# EAGLE design RFM22_AT90USB (EAGLE 5.11)
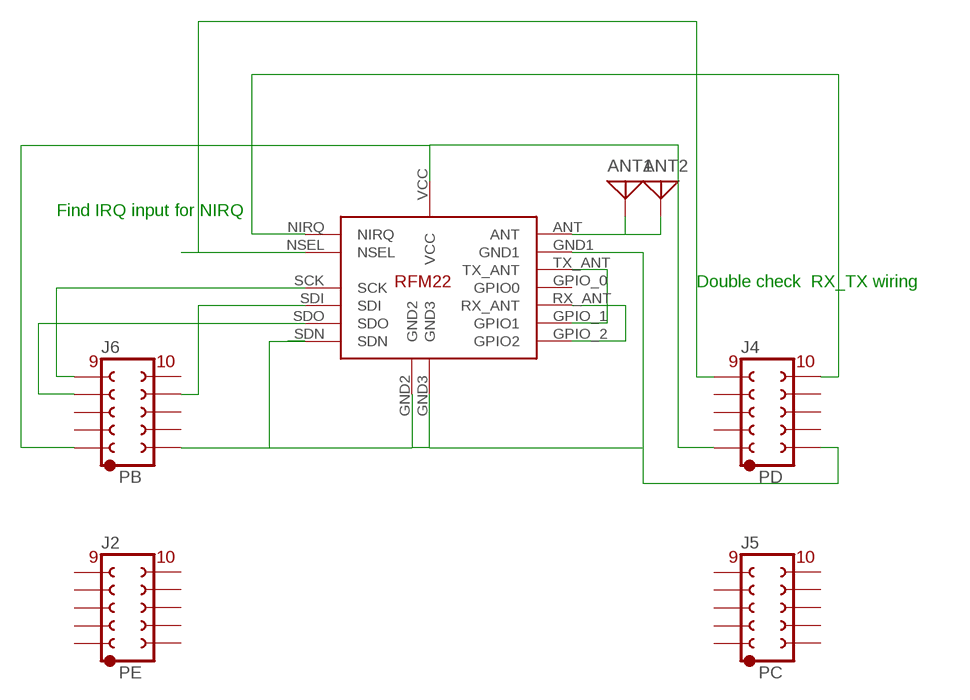
[diagram p0: schematic, sheet 1]

## Parts
ANT1  ANTENNA  [PAD-01]
ANT2  ANTENNA  [PAD-01]
J2  PE  HDR50X100  [5X2_50MILX100MIL]
J4  PD  HDR50X100  [5X2_50MILX100MIL]
J5  PC  HDR50X100  [5X2_50MILX100MIL]
J6  PB  HDR50X100  [5X2_50MILX100MIL]
U$1  RFM22  [RFM22]

## Nets
GND: J4.P$2 J6.P$2 U$1.GND1 U$1.GND2 U$1.GND3 U$1.SDN
N$1: J4.P$1 J6.P$1 U$1.VCC
N$3: J4.P$10 U$1.NIRQ
N$4: J6.P$9 U$1.SCK
N$5: J6.P$8 U$1.SDI
N$6: J6.P$7 U$1.SDO
N$7: J4.P$9 U$1.NSEL
N$9: U$1.GPIO_2(GPIO2) U$1.RX_ANT
N$10: U$1.GPIO_1(GPIO1) U$1.TX_ANT
N$11: ANT1.1 ANT2.1 U$1.ANT
Unconnected: J2.P$1 J2.P$2 J2.P$3 J2.P$4 J2.P$5 J2.P$6 J2.P$7 J2.P$8 J2.P$9 J2.P$10 J4.P$3 J4.P$4 J4.P$5 J4.P$6 J4.P$7 J4.P$8 J5.P$1 J5.P$2 J5.P$3 J5.P$4 J5.P$5 J5.P$6 J5.P$7 J5.P$8 J5.P$9 J5.P$10 J6.P$3 J6.P$4 J6.P$5 J6.P$6 J6.P$10 U$1.GPIO_0(GPIO0)

## Notes on the sheet
- Find IRQ input for NIRQ
- Double check  RX_TX wiring

## Library data of the parts
ANT1 ANT2 = discrete:ANTENNA: Antenna
J2 J4-J6 = MY_ATMEL:HDR50X100: Connector 2x5 50 mil by 100 mil, AVR
U$1 = MY_ATMEL:RFM22

## Board
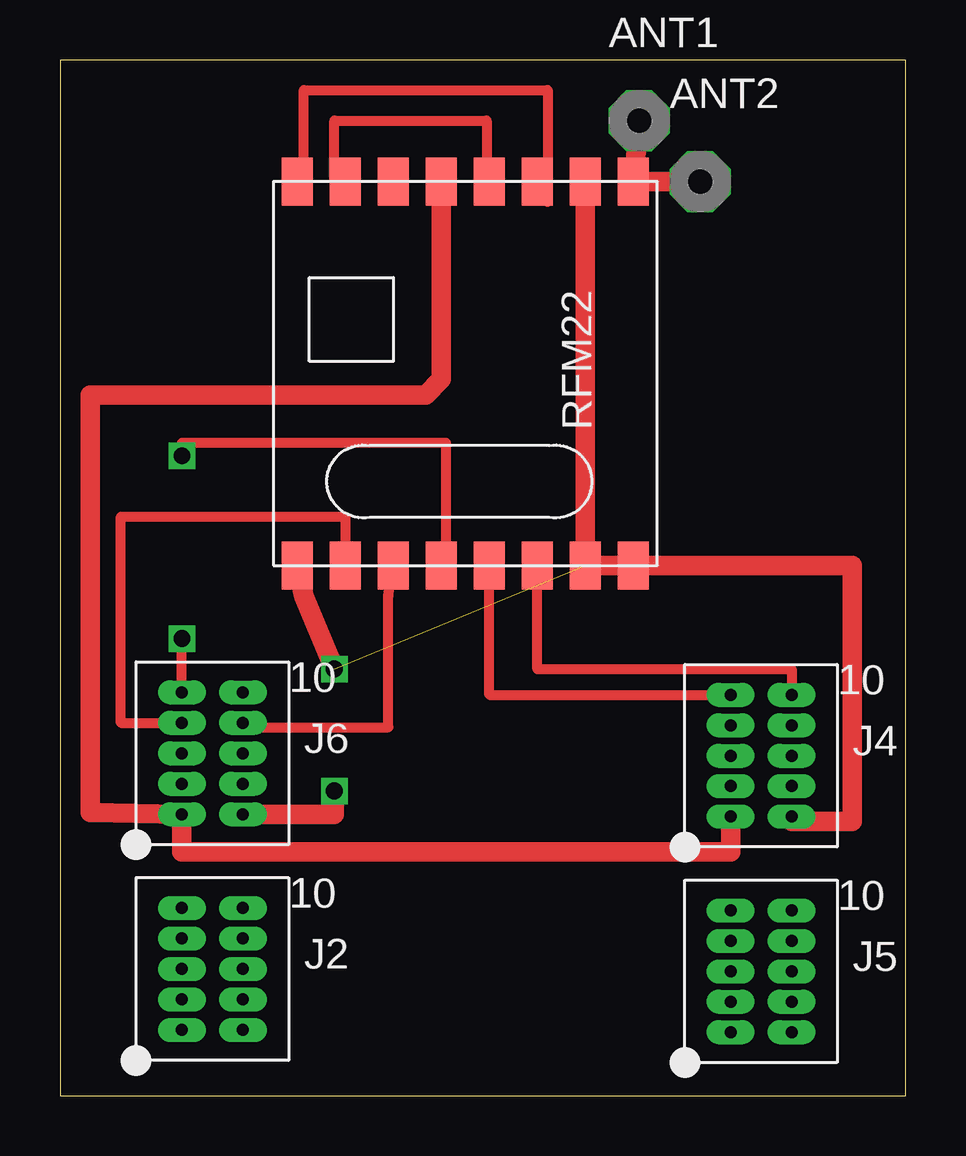
[diagram p1: board, top side]
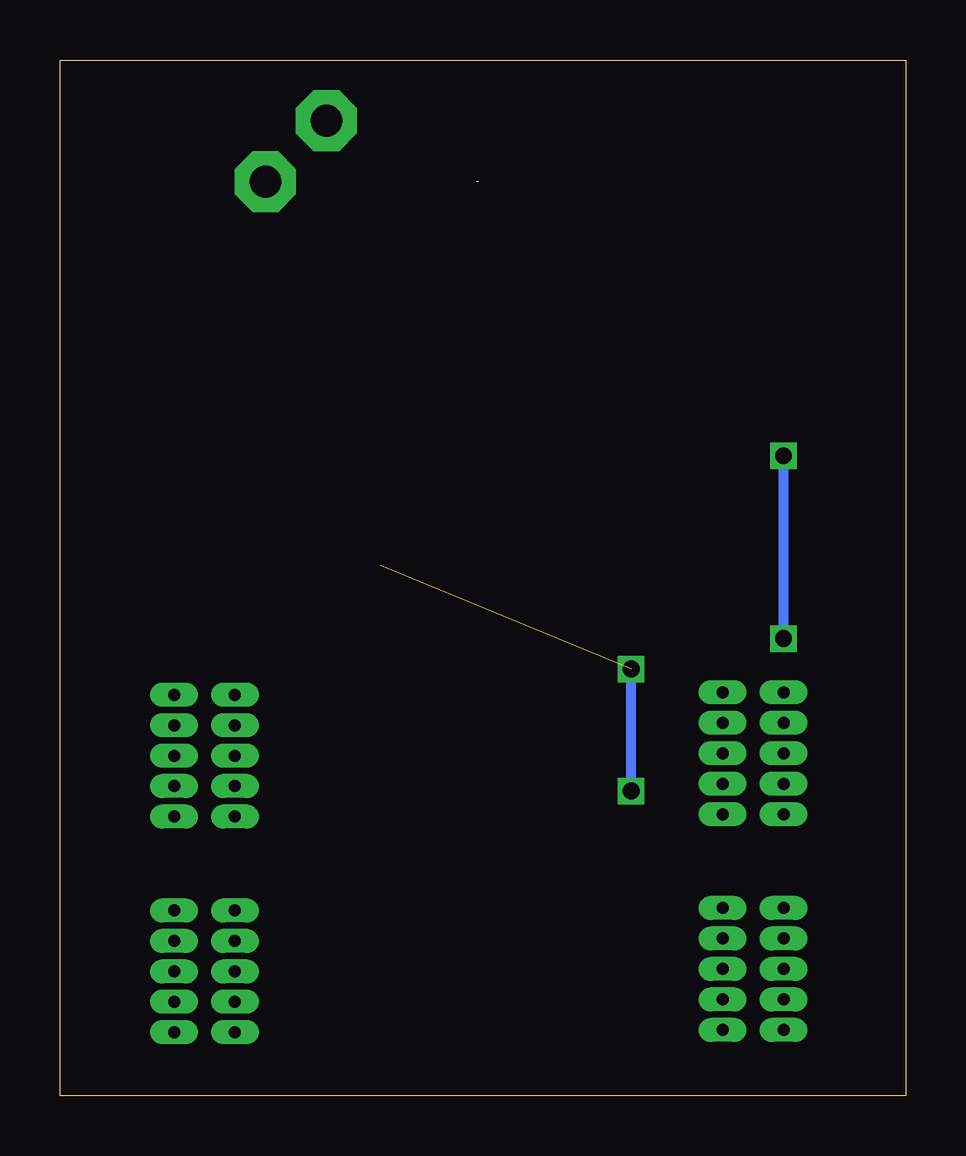
[diagram p2: board, bottom side, seen from below]

Size 35.23 x 43.17 mm. Coordinates in mm from the lower left corner, seen from the top.
Outline: 0,0 35.23,0 35.23,43.17 0,43.17 0,0
Copper layers (1*16): Top 0.035mm / dielectric 1.5mm / Bottom 0.035mm
Design rules "default": minimum track width 10mil, minimum drill 24mil, track to track 8mil, track to pad 8mil, pad to pad 8mil, via to via 8mil, smd to smd 8mil, copper to edge 40mil, drill to drill 8mil, minimum pad ring 10mil, minimum via ring 8mil, stop-mask expansion 4mil, vias tented up to drill 0mil, thermal gap 10mil

### Footprints (pad centres in the part's own frame; a part is rotated, then mirrored left to right if it is on the bottom)
PAD-01 = drill 1.321 pad 2.54 octagon: 1 0,0
5X2_50MILX100MIL = drill 0.5 long: P$1 -2.54,0; P$2 0,0; P$3 -2.54,1.27; P$4 0,1.27; P$5 -2.54,2.54; P$6 0,2.54; P$7 -2.54,3.81; P$8 0,3.81; P$9 -2.54,5.08; P$10 0,5.08
RFM22 = smd 2 x 1.3: ANT 0,15; GND1 0,13; GND2 16,15; GND3 16,1; GPIO_0 0,5; GPIO_1 0,3; GPIO_2 0,1; NIRQ 16,11; NSEL 16,9; RX_ANT 0,11; SCK 16,7; SDI 16,5; SDN 16,13; SDO 16,3; TX_ANT 0,9; VCC 0,7

### Placement (x,y rotation side)
ANT1  24.13,40.64 0 top
ANT2  26.67,38.1 0 top
J2  7.62,2.74 0 top
J4  30.48,11.63 0 top
J5  30.48,2.64 0 top
J6  7.62,11.73 0 top
U$1  8.89,38.1 270 top

### Tracks (layer width: path | path; a pad name or v marks a point on that pad's centre or on a via)
GND  (via drill 0.7)  (1 unrouted)
  Top 0.406: 30.48,11.43 J4.P$2 | U$1.GND2 24.13,22.1 24.13,21.59
  Top 0.813: 24.13,22.1 33.02,22.1 33.02,11.43 30.48,11.43 | U$1.GND1 U$1.SDN U$1.GND2 | U$1.GND3 10.16,20.83 v11.43,17.78 | v11.43,12.7 11.43,11.73 J6.P$2
  Bottom 0.406: v11.43,12.7 v11.43,17.78
N$1
  Top 0.406: 27.94,11.43 J4.P$1
  Top 0.813: 27.94,11.43 27.94,10.16 5.08,10.16 J6.P$1 1.27,11.8 1.27,29.21 15.24,29.21 15.89,29.86 U$1.VCC
N$3
  Top 0.406: J4.P$10 30.48,17.78 19.89,17.78 U$1.NIRQ
N$4  (via drill 0.7)
  Top 0.406: U$1.SCK 16.08,22.1 16.08,27.22 5.08,27.22 v5.08,26.67 | J6.P$9 v5.08,19.05
  Bottom 0.406: v5.08,19.05 v5.08,26.67
N$5
  Top 0.406: U$1.SDI 13.68,20.83 13.68,15.35 7.62,15.35 J6.P$8
N$6
  Top 0.406: J6.P$7 2.54,15.54 2.54,24.13 11.89,24.13 U$1.SDO
N$7
  Top 0.406: J4.P$9 17.89,16.71 U$1.NSEL
N$9
  Top 0.406: U$1.GPIO_2 10.16,38.1 10.16,41.91 20.32,41.91 20.32,37.26 arc-90 U$1.RX_ANT
N$10  (1 unrouted)
  Top 0.406: U$1.GPIO_1 11.43,38.1 11.43,40.64 17.78,40.64 17.78,38.1
N$11
  Top 0.813: ANT1.1 U$1.ANT ANT2.1